# Altium project 一体机V1 修订2.PrjPcb (part 2 of 2)

## Sheet GPS POWER.SchDoc
size A4
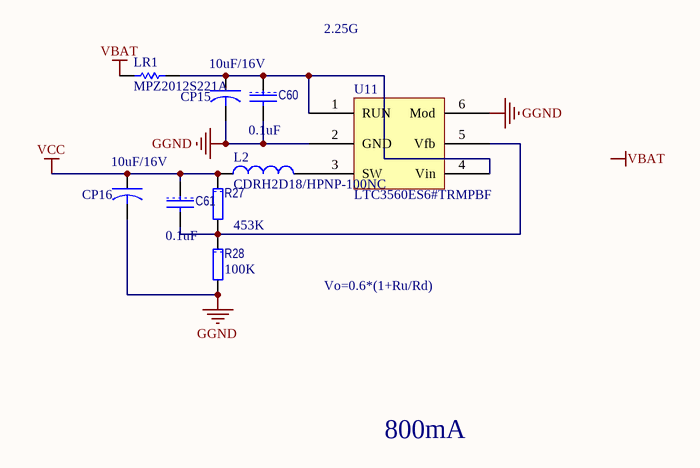
[diagram p21: GPS POWER.SchDoc]

### Parts
C60  value 0.1uF  [1608[0603]C]  (hidden comment: C1608X7R1H104K)
C61  value 0.1uF  [1608[0603]C]  (hidden comment: C1608X7R1H104K)
CP15  value 10uF/16V  [3216[1206]CB]  (hidden comment: TAJA106K016RNJ)
CP16  value 10uF/16V  [3216[1206]CB]  (hidden comment: TAJA106K016RNJ)
L2  CDRH2D18/HPNP-100NC  [INDP3232]
LR1  MPZ2012S221A  [2012[0805]]
R27  value 453K  [1608[0603]R]  (hidden comment: TNPW0603453KBEEN)
R28  value 100K  [1608[0603]R]  (hidden comment: CRCW0603100KFKEA)
U11  LTC3560ES6#TRMPBF  [SOT26A-6N]

### Nets
GGND: C60.2 CP15.2 CP16.2 R28.2 U11.2(GND) U11.6(Mod)  [project net GND]
VBAT: LR1.2
VCC: C61.1 CP16.1 L2.1 R27.1
NetC60_1: C60.1 CP15.1 LR1.1 U11.1(RUN) U11.4(Vin)
NetC61_2: C61.2 R27.2 R28.1 U11.5(Vfb)
NetL2_2: L2.2 U11.3(SW)

### Notes on the sheet
- 2.25G
- Vo=0.6*(1+Ru/Rd)
- 800mA
- Labels drawn without touching a wire or pin: VBAT

### Library data of the parts
C60 C61 = CAP: 多层陶瓷电容器MLCC - SMD/SMT 0603 0.1uF 50volts X7R 10%; Manufacturer: TDK; 产品: General Type MLCCs; 产品种类: Low & Medium Capacitance SMD Ceramic Chip Capacitors; 外壳代码 - in: 0603; 外壳代码 - mm: 1608; 封装 / 箱体: 0603 (1608 metric); 封装: Reel; 尺寸: 0.8 mm W x 1.6 mm L x 0.8 mm H; 工作温度范围: - 55 C to + 125 C; 标准包装数量: 4000; 电压额定值: 50 V; 电容-nF: 100 nF; 电容-pF: 100000 pF; 系列: C; Category: 多层陶瓷电容器MLCC - SMD/SMT; ComponentLink1Description: http://www.tdk.com/pdf/general_B11.pdf; ComponentLink1URL: http://www.tdk.com/pdf/general_B11.pdf; Description 1: 多层陶瓷电容器MLCC - SMD/SMT 0603 0.1uF 50volts X7R 10%; Manufacturer Part Number: C1608X7R1H104K; Minimum Order Quantity: 1; Pricing 1: 1=0.160, 50=0.070, 100=0.036, 500=0.019, 1000=0.013, 4000=0.010, 8000=0.009, 12000=0.008, 20000=0.007 (USD); Reeling: True; RoHS - 贸泽: Y; RoHS: RoHS Compliant; Stock 1: 224604; Supplier 1: Mouser; Supplier Part Number 1: 810-C1608X7R1H104K; 制造商: TDK; 容差: 10 %; 温度系数/代码: X7R; 电容: 0.1 uF; 端接类型: SMD/SMT
CP15 CP16 = CAPACITOR: 钽质电容器-固体SMD 16volts 10uF 10%; Manufacturer: AVX; ESR: 3 Ohms; 产品: Tantalum Solid Standard Grade - Other Various; 产品种类: SMD Tantalum Capacitors; 制造商库存号: A Case; 外壳代码 - in: 1206; 外壳代码 - mm: 3216; 封装 / 箱体: 1206 (3216 metric); 封装: Reel; 尺寸: 1.6 mm W x 3.2 mm L; 工作温度范围: - 55 C to + 125 C; 损耗因数 DF: 8; 标准包装数量: 2000; 漏泄电流: 1.6 uA; 电压额定值: 16 V; 端接类型: SMD/SMT; 系列: TAJ; 高度: 1.8 mm; Category: 钽质电容器-固体SMD; ComponentLink1Description: http://www.avx.com/docs/Catalogs/taj.pdf; ComponentLink1URL: http://www.avx.com/docs/Catalogs/taj.pdf; Description 1: 钽质电容器-固体SMD 16volts 10uF 10%; Manufacturer Part Number: TAJA106K016RNJ; Minimum Order Quantity: 1; Pricing 1: 1=0.600, 100=0.280, 200=0.250, 500=0.221, 1000=0.200, 2000=0.140, 5000=0.131, 10000=0.124, 25000=0.103 (USD); Reeling: True; RoHS - 贸泽: Y; RoHS: RoHS Compliant; Stock 1: 20335; Supplier 1: Mouser; Supplier Part Number 1: 581-TAJA106K016R; 制造商: AVX; 容差: 10 %; 电容: 10 uF
L2 = Inductor: 固定电感器 10uH 430mA; Manufacturer: Sumida; 尺寸: 3.2 mm W x 3.2 mm L x 2 mm H; 最大直流电流: 0.85 A; 最大直流电阻: 245 mOhms; 封装: Reel; 产品: SMD Power Inductor; 系列: CDRH; 屏蔽: Shielded; 端接类型: SMD/SMT; 容差: 30 %; 外壳高度: 2 mm; 外壳长度: 3.2 mm; 产品种类: SMD Power Inductors Shielded; 标准包装数量: 1000; 测试频率: 100 kHz; Supplier 1: Mouser; Supplier Part Number 1: 851-CDRH2D18HP-100NC; Manufacturer Part Number: CDRH2D18/HPNP-100NC; RoHS: RoHS Compliant; Description 1: 固定电感器 10uH 430mA; Category: 固定电感器; Stock 1: 1271; Pricing 1: 1=0.810, 10=0.650, 100=0.590, 500=0.540, 1000=0.490, 5000=0.450, 10000=0.410, 25000=0.370 (USD); 电感: 10 uH; 外壳宽度: 3.2 mm; 制造商: Sumida; RoHS - 贸泽: Y; Minimum Order Quantity: 1; Reeling: True; ComponentLink1URL: http://www.mouser.com/ds/2/390/cdrh2d18hp-189473.pdf; ComponentLink1Description: http://www.mouser.com/ds/2/390/cdrh2d18hp-189473.pdf; Value: 10uH
LR1 = Res Semi: 电磁干扰滤波珠子、扼流圈和阵列 Ferrite Chip Beads; Manufacturer: TDK; 阻抗: 220 Ohms; 最大直流电流: 3 A; 最大直流电阻: 0.04 Ohms; 工作温度范围: - 55 C to + 125 C; 封装 / 箱体: 2012; 封装: Reel; 端接类型: SMD/SMT; 容差: 25 %; 产品种类: Ferrite Beads; 标准包装数量: 4000; Supplier 1: Mouser; Supplier Part Number 1: 810-MPZ2012S221A; Manufacturer Part Number: MPZ2012S221A; RoHS: RoHS Compliant; Description 1: 电磁干扰滤波珠子、扼流圈和阵列 Ferrite Chip Beads; Category: 电磁干扰滤波珠子、扼流圈和阵列; Stock 1: 26540; Pricing 1: 1=0.070, 50=0.060, 100=0.053, 500=0.040, 1000=0.035, 4000=0.031, 8000=0.029, 12000=0.025 (USD); 制造商: TDK; RoHS - 贸泽: Y; Minimum Order Quantity: 1; Reeling: True; ComponentLink1URL: http://www.mouser.com/ds/2/400/e9413_mpz-24582.pdf; ComponentLink1Description: http://www.mouser.com/ds/2/400/e9413_mpz-24582.pdf
R27 = RES: 薄膜电阻器 - SMD 453Kohms .1% 25ppm; Manufacturer: Vishay; Manufacturer Part Number: TNPW0805453KBEEN; 尺寸: 1.25 mm W x 2 mm L x 0.45 mm H; 工作温度范围: - 55 C to + 155 C; 封装 / 箱体: 0805 (2012 metric); 封装: Reel; 功率额定值: 125 mW (1/8 W); 产品: Precision Resistors Thin Film SMD; 系列: TNPW; 温度系数: 25 PPM / K; 端接类型: SMD/SMT; 容差: 0.1 %; 电压额定值: 150 V; 外壳高度: 0.45 mm; 外壳长度: 2 mm; 外壳宽度: 1.25 mm; 产品种类: 0805 Precision Thin Film Chip Resistors; 标准包装数量: 1000; Supplier 1: Mouser; Supplier Part Number 1: 71-TNPW0805453KBEEN; RoHS: RoHS Compliant; Description 1: 薄膜电阻器 - SMD 453Kohms .1% 25ppm; Category: 薄膜电阻器 - SMD; Stock 1: 0; Pricing 1: 1=0.940, 50=0.800, 100=0.650, 500=0.580, 1000=0.522, 2000=0.464, 4000=0.455, 6000=0.450, 8000=0.440 (USD); 电阻: 453 kOhms; 制造商: Vishay; RoHS - 贸泽: E; Minimum Order Quantity: 1; Reeling: True; ComponentLink1URL: http://www.vishay.com/doc?28758; ComponentLink1Description: http://www.vishay.com/doc?28758
R28 = RES: as R73 on sheet 12-MSP430; Supplier 1: Mouser; Supplier Part Number 1: 71-CRCW0603-100K-E3; Manufacturer Part Number: CRCW0603100KFKEA; RoHS: RoHS Compliant By Exemption; Category: 厚膜电阻器 - SMD; Stock 1: 175756; Pricing 1: 1=0.080, 10=0.013, 100=0.010, 1000=0.008, 5000=0.005, 25000=0.004, 50000=0.003 (USD); 电阻: 100 kOhms; 容差: 1 %; RoHS - 贸泽: E; Minimum Order Quantity: 1; Reeling: True; ComponentLink1URL: http://www.mouser.com/ds/2/427/dcrcwe3-109170.pdf; ComponentLink1Description: http://www.mouser.com/ds/2/427/dcrcwe3-109170.pdf; Description 1: 厚膜电阻器 - SMD 1/10watt 100Kohms 1%
U11 = LTC3405A: IC REG BUCK SYNC ADJ TSOT23-6; Manufacturer: Linear Technology; Output Type: Adjustable; Number of Outputs: 1; Voltage - Output: 0.6 V ~ 5.5 V; Voltage - Input: 2.5 V ~ 5.5 V; PWM Type: Current Mode, Burst Mode?; Frequency - Switching: 2.25MHz; Current - Output: 800mA; Synchronous Rectifier: Yes; Supplier 1: Digi-Key; Supplier Part Number 1: LTC3560ES6#TRMPBFCT-ND; Manufacturer Part Number: LTC3560ES6#TRMPBF; RoHS: RoHS Compliant; Description 1: IC REG BUCK SYNC ADJ TSOT23-6; Category: Integrated Circuits (ICs); Stock 1: 2081; Pricing 1: 1=4.39, 25=3.9196, 100=3.5276 (USD); Packaging: Cut Tape (CT); Type: Step-Down (Buck); Operating Temperature: -40°C ~ 85°C; Mounting Type: Surface Mount; Package / Case: SOT-23-6 Thin, TSOT-23-6; Supplier Device Package: TSOT-23-6; ComponentLink1URL: http://www.linear.com/docs/18318; ComponentLink1Description: http://www.linear.com/docs/18318

## Sheet BAT POWER.SchDoc
size A4
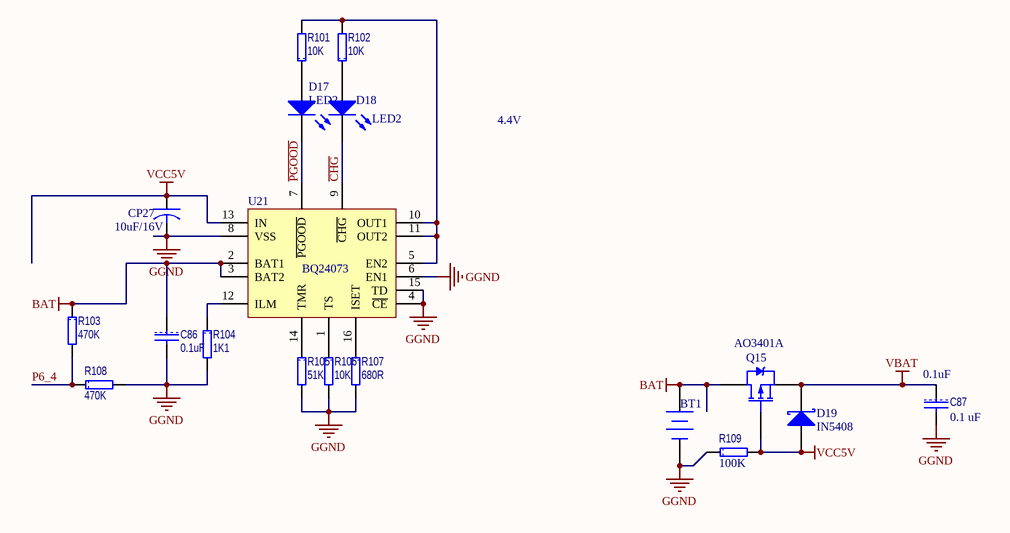
[diagram p22: BAT POWER.SchDoc]

### Parts
BT1  Battery  [BAT-2]  (value not drawn)
C86  0.1uF  [1608[0603]]
C87  value 0.1uF  电容: 0.1 uF  [1608[0603]C]  (hidden comment: C1608X7R1H104K)
CP27  10uF/16V  [3216[1206]]
D17  LED2  [0805LED]
D18  LED2  [0805LED]
D19  IN5408  [DO-214AB/SMC]
Q15  AO3401A  [SOT23_N]
R101  10K  [1608[0603]R]
R102  10K  [1608[0603]R]
R103  470K  [1608[0603]R]
R104  1K1  [1608[0603]R]
R105  51K  [1608[0603]R]
R106  10K  [1608[0603]R]
R107  680R  [1608[0603]R]
R108  470K  [1608[0603]R]
R109  value 100K  [1608[0603]R]  (hidden comment: CRCW0603100KFKEA)
U21  BQ24073  [BQ24073]

### Nets
BAT: BT1.1(+) C86.1 Q15.3(D) R103.1 U21.2(BAT1) U21.3(BAT2)
GGND: BT1.2(-) C86.2 C87.2 CP27.2 R104.2 R105.2 R106.2 R107.2 R108.2 R109.1 U21.4(~{CE}) U21.6(EN1) U21.8(VSS) U21.15(TD)  [project net GND]
VBAT: C87.1 D19.2(K) Q15.2(S)
VCC5V: CP27.1 D19.1(A) Q15.1(G) R109.2 U21.13(IN)
~{CHG}: D18.2(K) U21.9(~{CHG})
P6_4: R103.2 R108.1
~{PGOOD}: D17.2(K) U21.7(~{PGOOD})
NetD17_1: D17.1(A) R101.1
NetD18_1: D18.1(A) R102.1
NetR101_2: R101.2 R102.2 U21.5(EN2) U21.10(OUT1) U21.11(OUT2)
NetR104_1: R104.1 U21.12(ILM)
NetR105_1: R105.1 U21.14(TMR)
NetR106_1: R106.1 U21.1(TS)
NetR107_1: R107.1 U21.16(ISET)

### Notes on the sheet
- 4.4V

### Library data of the parts
BT1 = Battery: 插针 Multicell Battery; Published: 24-Mar-1999; LatestRevisionDate: 17-Jul-2002; LatestRevisionNote: Re-released for DXP Platform.; PackageReference: BAT-2; Publisher: Altium Limited
C86 = CAP: Capacitor; Manufacturer: TDK; Type: 无铅电容; Model: C0603X7R1H104K; Value: 0.1uF
C87 = CAP: 多层陶瓷电容器MLCC - SMD/SMT 0603 0.1uF 50volts X7R 10%; Manufacturer: TDK; 尺寸: 0.8 mm W x 1.6 mm L x 0.8 mm H; 工作温度范围: - 55 C to + 125 C; 封装 / 箱体: 0603 (1608 metric); 封装: Reel; 产品: General Type MLCCs; 系列: C; 电压额定值: 50 V; 电容-nF: 100 nF; 电容-pF: 100000 pF; 外壳代码 - in: 0603; 外壳代码 - mm: 1608; 产品种类: Low & Medium Capacitance SMD Ceramic Chip Capacitors; 标准包装数量: 4000; Supplier 1: Mouser; Supplier Part Number 1: 810-C1608X7R1H104K; Manufacturer Part Number: C1608X7R1H104K; RoHS: RoHS Compliant; Description 1: 多层陶瓷电容器MLCC - SMD/SMT 0603 0.1uF 50volts X7R 10%; Category: 多层陶瓷电容器MLCC - SMD/SMT; Stock 1: 224604; Pricing 1: 1=0.160, 50=0.070, 100=0.036, 500=0.019, 1000=0.013, 4000=0.010, 8000=0.009, 12000=0.008, 20000=0.007 (USD); 端接类型: SMD/SMT; 容差: 10 %; 制造商: TDK; 温度系数/代码: X7R; RoHS - 贸泽: Y; Minimum Order Quantity: 1; Reeling: True; ComponentLink1URL: http://www.tdk.com/pdf/general_B11.pdf; ComponentLink1Description: http://www.tdk.com/pdf/general_B11.pdf
CP27 = CAPACITOR: Tantalum Capacitor; 公司: TAJ; name: TAJ-A-106-M-010-R; value: 10uF/16V
D17 D18 = LED2: Typical RED, GREEN, YELLOW, AMBER GaAs LED; Published: 8-Jun-2000; LatestRevisionDate: 17-Jul-2002; LatestRevisionNote: Re-released for DXP Platform.; PackageVersion: Feb-2002; PackageReference: 3.2X1.6X1.1; Publisher: Altium Limited; PackageDescription: SM LED; 2 Flat Leads
D19 = D Schottky: 肖特基二极管与整流器 3.0 Amp 60 Volt; Manufacturer: Vishay Semiconductors; Manufacturer Part Number: SS36-E3/57T; 配置: Single; 工作温度范围: - 55 C to + 150 C; 封装 / 箱体: SMC (DO-214AB); 封装: Reel; 产品: Schottky Rectifiers; 正向连续电流: 3 A; 最大浪涌电流: 100 A; 安装风格: SMD/SMT; 正向电压下降: 0.75 V; 制造商: Vishay; 最大反向漏泄电流: 500 uA; 峰值反向电压: 60 V; 标准包装数量: 850; Supplier 1: Mouser; Supplier Part Number 1: 625-SS36-E3; RoHS: RoHS Compliant By Exemption; Description 1: 肖特基二极管与整流器 3.0 Amp 60 Volt; Category: 肖特基二极管与整流器; Stock 1: 481; Pricing 1: 1=0.280, 10=0.250, 100=0.188, 250=0.154, 500=0.144, 850=0.144, 1000=0.139, 2000=0.131 (USD); 产品种类: Schottky Rectifiers; RoHS - 贸泽: E; Minimum Order Quantity: 1; Reeling: True; ComponentLink1URL: http://www.mouser.com/ds/2/427/88751-106389.pdf; ComponentLink1Description: http://www.mouser.com/ds/2/427/88751-106389.pdf
Q15 = IRLML5103: MOSFET P-CH -30V -4.3A SOT23; Manufacturer: Alpha & Omega Semiconductor Inc; FET Type: MOSFET P-Channel, Metal Oxide; FET Feature: Logic Level Gate, 2.5V Drive; Drain to Source Voltage (Vdss): 30V; Current - Continuous Drain (Id) @ 25° C: 4.3A (Ta); Rds On (Max) @ Id, Vgs: 44 mOhm @ 4.3A, 10V; Vgs(th) (Max) @ Id: 1.3V @ 250μA; Gate Charge (Qg) @ Vgs: 12.2nC @ 4.5V; Input Capacitance (Ciss) @ Vds: 1200pF @ 15V; Power - Max: 1.4W; Supplier 1: Digi-Key; Supplier Part Number 1: 785-1001-6-ND; Manufacturer Part Number: AO3401A; RoHS: RoHS Compliant; Description 1: MOSFET P-CH -30V -4.3A SOT23; Category: Discrete Semiconductor Products; Stock 1: 75922; Pricing 1: 1=0.48, 25=0.2792, 100=0.225, 250=0.162, 500=0.1305, 1000=0.10125 (USD); Packaging: Digi-Reel?; Mounting Type: Surface Mount; Package / Case: TO-236-3, SC-59, SOT-23-3; Supplier Device Package: SOT-23-3; ComponentLink1URL: http://www.aosmd.com/res/data_sheets/AO3401A.pdf; ComponentLink1Description: http://www.aosmd.com/res/data_sheets/AO3401A.pdf
R101 R102 = RES: Model: CRCW060310K0KKEDTR; 公司: vishay; Parameters: 50V 1/10W 0.5%; Type: 无铅电阻; Value: 10K
R103 R108 = RES: Manufacturer: vishay; Model: CRCW0603470K0KKEDTR; Value: 470K; Type: 无铅电阻
R104 = RES: Manufacturer: vishay; Model: RT0603DRD7D1K1L; Parameters: 50V 1/10W 0.5%; Type: 无铅电阻; Value: 1K1
R105 = RES: Manufacturer: vishay; Model: RT0603DRD7D51KL; Parameters: 50V 1/10W 0.5%; Type: 无铅电阻; Value: 51K
R106 = RES: Manufacturer: vishay; Model: CRCW060310K0KKEDTR; Parameters: 50V 1/10W 0.5%; Type: 无铅电阻; Value: 10K
R107 = RES: Manufacturer: vishay; Model: RT0603DRD7D680RL; Parameters: 50V 1/10W 0.5%; Type: 无铅电阻; Value: 680R
R109 = RES: as R73 on sheet 12-MSP430; Supplier 1: Mouser; Supplier Part Number 1: 71-CRCW0603-100K-E3; Manufacturer Part Number: CRCW0603100KFKEA; RoHS: RoHS Compliant By Exemption; Category: 厚膜电阻器 - SMD; Stock 1: 175756; Pricing 1: 1=0.080, 10=0.013, 100=0.010, 1000=0.008, 5000=0.005, 25000=0.004, 50000=0.003 (USD); 电阻: 100 kOhms; 容差: 1 %; RoHS - 贸泽: E; Minimum Order Quantity: 1; Reeling: True; ComponentLink1URL: http://www.mouser.com/ds/2/427/dcrcwe3-109170.pdf; ComponentLink1Description: http://www.mouser.com/ds/2/427/dcrcwe3-109170.pdf; Description 1: 厚膜电阻器 - SMD 1/10watt 100Kohms 1%

## Sheet CD4060BM_硬件定时器.SchDoc
size A4
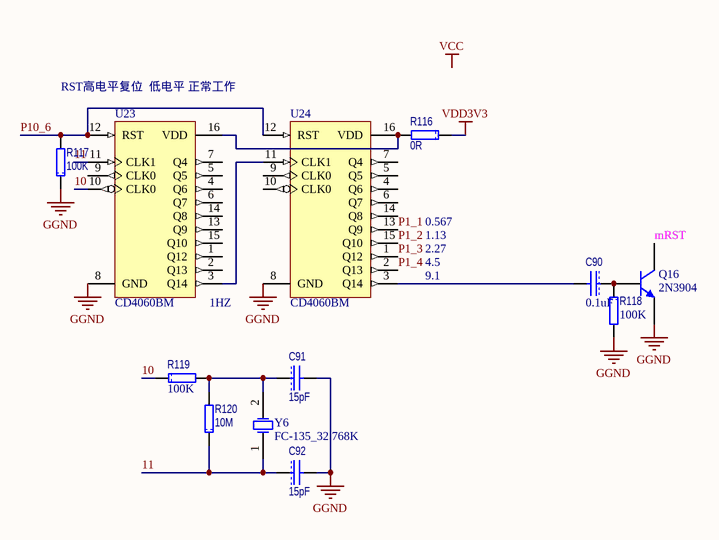
[diagram p23: CD4060BM_硬件定时器.SchDoc]

### Parts
C90  value 0.1uF  [1608[0603]C]  (hidden comment: C1608X7R1H104K)
C91  15pF  [1608[0603]]
C92  15pF  [1608[0603]]
Q16  2N3904  [SOT23_N]
R116  0R  [1608[0603]R]
R117  100K  [1608[0603]R]
R118  value 100K  [1608[0603]R]  (hidden comment: CRCW0603100KFKEA)
R119  value 100K  [1608[0603]R]  (hidden comment: CRCW0603100KFKEA)
R120  10M  [1608[0603]R]
U23  CD4060BM  [SOIC16_N]
U24  CD4060BM  [SOIC16_N]
Y6  FC-135_32.768K  [FC-135]

### Nets
GGND: C91.2 C92.2 Q16.1(E) R117.1 R118.2 U23.8(GND) U24.8(GND)  [project net GND]
VDD3V3: R116.1
10: R119.1 U23.10(CLK0)
11: C92.1 R120.1 U23.11(CLK1) Y6.1(OSC1)
mRST: Q16.3(C)
P1_1: U24.13(Q9)
P1_2: U24.15(Q10)
P1_3: U24.1(Q12)
P1_4: U24.2(Q13)
P10_6: R117.2 U23.12(RST) U24.12(RST)
NetC90_1: C90.1 Q16.2(B) R118.1
NetC90_2: C90.2 U24.3(Q14)
NetC91_1: C91.1 R119.2 R120.2 Y6.2(OSC2)
NetR116_2: R116.2 U23.16(VDD) U24.16(VDD)
NetU23_3: U23.3(Q14) U24.11(CLK1)

Not connected (* = marked no-connect by the designer): U23 1(Q12) 2(Q13) 4(Q6) 5(Q5) 6(Q7) 7(Q4) 9(CLK0) 13(Q9) 14(Q8) 15(Q10); U24 4(Q6) 5(Q5) 6(Q7) 7(Q4) 9(CLK0) 10(CLK0) 14(Q8)

### Notes on the sheet
- RST高电平复位  低电平 正常工作
- 2.27
- 1.13
- 0.567
- (near U23) 1HZ
- 9.1
- 4.5
- Labels drawn without touching a wire or pin: VCC

### Library data of the parts
C90 = CAP: 多层陶瓷电容器MLCC - SMD/SMT 0603 0.1uF 50volts X7R 10%; Manufacturer: TDK; 产品: General Type MLCCs; 产品种类: Low & Medium Capacitance SMD Ceramic Chip Capacitors; 外壳代码 - in: 0603; 外壳代码 - mm: 1608; 封装 / 箱体: 0603 (1608 metric); 封装: Reel; 尺寸: 0.8 mm W x 1.6 mm L x 0.8 mm H; 工作温度范围: - 55 C to + 125 C; 标准包装数量: 4000; 电压额定值: 50 V; 电容-nF: 100 nF; 电容-pF: 100000 pF; 系列: C; Category: 多层陶瓷电容器MLCC - SMD/SMT; ComponentLink1Description: http://www.tdk.com/pdf/general_B11.pdf; ComponentLink1URL: http://www.tdk.com/pdf/general_B11.pdf; Description 1: 多层陶瓷电容器MLCC - SMD/SMT 0603 0.1uF 50volts X7R 10%; Manufacturer Part Number: C1608X7R1H104K; Minimum Order Quantity: 1; Pricing 1: 1=0.160, 50=0.070, 100=0.036, 500=0.019, 1000=0.013, 4000=0.010, 8000=0.009, 12000=0.008, 20000=0.007 (USD); Reeling: True; RoHS - 贸泽: Y; RoHS: RoHS Compliant; Stock 1: 224604; Supplier 1: Mouser; Supplier Part Number 1: 810-C1608X7R1H104K; 制造商: TDK; 容差: 10 %; 温度系数/代码: X7R; 电容: 0.1 uF; 端接类型: SMD/SMT
C91 C92 = CAP: Capacitor; Manufacturer: TDK; Type: 无铅电容; Model: C0603X7R1H150K; Value: 15pF
Q16 = 2N3904: NPN General Purpose Amplifier; Published: 8-Jun-2000; LatestRevisionDate: 15-Jan-2003; LatestRevisionNote: PCB Footprint 'BCY-W3/D4.7' replaced; DatasheetVersion: 1997; PackageVersion: Sep-1998; PackageReference: TO-92A; Publisher: Altium Limited; PackageDescription: TO, Flat Index; 3 In-Line, Axial Leads; Body Dia. 4.5mm; Leads 0.51 x 0.48 mm (max); ComponentLink1Description: Manufacturer Link; ComponentLink1URL: http://www.fairchildsemi.com/; ComponentLink2Description: Datasheet; ComponentLink2URL: http://www.fairchildsemi.com/ds/2N%2F2N3904.pdf
R116 = RES: Model: RT0603DRD7D0RL; 公司: vishay; Parameters: 50V 1/10W 0.5%; Type: 无铅电阻; Value: 0R
R117 = RES: Model: RT0603DRD7D100KL; 公司: vishay; Parameters: 50V 1/10W 0.5%; Type: 无铅电阻; Value: 100K
R118 R119 = RES: 厚膜电阻器 - SMD 1/10watt 100Kohms 1%; Manufacturer: Vishay / Dale; 尺寸: 0.85 mm W x 1.55 mm L x 0.45 mm H; 工作温度范围: - 55 C to + 155 C; 封装 / 箱体: 0603 (1608 metric); 封装: Reel; 功率额定值: 100 mW; 产品: Thick Film Resistors SMD; 系列: CRCW; 温度系数: 100 PPM / K; 端接类型: SMD/SMT; 电压额定值: 75 V; 制造商: Vishay; 产品种类: 0603 Thick Film Chip Resistors; 标准包装数量: 5000; 外壳代码 - in: 0603; 外壳代码 - mm: 1608; Supplier 1: Mouser; Supplier Part Number 1: 71-CRCW0603-100K-E3; Manufacturer Part Number: CRCW0603100KFKEA; RoHS: RoHS Compliant By Exemption; Category: 厚膜电阻器 - SMD; Stock 1: 175756; Pricing 1: 1=0.080, 10=0.013, 100=0.010, 1000=0.008, 5000=0.005, 25000=0.004, 50000=0.003 (USD); 电阻: 100 kOhms; 容差: 1 %; RoHS - 贸泽: E; Minimum Order Quantity: 1; Reeling: True; ComponentLink1URL: http://www.mouser.com/ds/2/427/dcrcwe3-109170.pdf; ComponentLink1Description: http://www.mouser.com/ds/2/427/dcrcwe3-109170.pdf; Description 1: 厚膜电阻器 - SMD 1/10watt 100Kohms 1%
R120 = RES: Model: RT0603DRD7D10ML; 公司: vishay; Parameters: 50V 1/10W 0.5%; Type: 无铅电阻; Value: 10M
U23 U24 = CD4060BCM: 14-Stage Ripple Carry Binary Counter; Published: 17-Jul-2002; LatestRevisionDate: 13-Apr-2006; LatestRevisionNote: IPC-7351 Footprint Added.; DatasheetVersion: Jan-1999; PackageVersion: 2000; PackageReference: M16A; Publisher: Altium Limited; PackageDescription: 16-Pin Small Outline Integrated Circuit 1.27 mm Pitch; Code_IPC: SOIC127P600-16; ComponentLink1Description: Manufacturer Link; ComponentLink1URL: http://www.fairchildsemi.com/; ComponentLink2Description: Datasheet; ComponentLink2URL: http://www.fairchildsemi.com/ds/CD%2FCD4040BC.pdf
Y6 = XTAL: Crystal Oscillator; 公司: EPSON; Published: 8-Jun-2000; LatestRevisionDate: 17-Jul-2002; LatestRevisionNote: Re-released for DXP Platform.; PackageReference: R38; Publisher: Altium Limited; PackageDescription: Crystal, Thru-Hole; 2 Leads; Body 3.1 x 8.2 mm (Dia.xH); Value: 32.768K

## Nets that join several sheets
GND: ARM POWER (12 pins), MAIN POWER (12 pins), JTAG (R48.2), RTC (B1.2), 按键接口 (5 pins), IIC (7 pins), RESET (C66.2 U13.1), USB Device (R57.2 U14.2 US1.5), USB Host (C83.2 C84.2 R97.2 R100.2), 蜂鸣器 (Q5.2 R69.2), Cores POWER (6 pins), LVDS (7 pins), 12-MSP430 (22 pins), 13-GPRS (16 pins), 14-GPS (17 pins), GPS POWER (6 pins), BAT POWER (14 pins), CD4060BM_硬件定时器 (7 pins)
VAA5V: ARM POWER (C54.1 CP9.1 U8.3), MAIN POWER (Q2.3 R52.2 RD7.2), 按键接口 (CP18.1 RF3.2), USB Device (US1.1), Cores POWER (C58.1 CP13.1 U10.3)
VBAT: 13-GPRS (5 pins), 14-GPS (LR4.2 R89.2 R90.2), GPS POWER (LR1.2), BAT POWER (C87.1 D19.2 Q15.2)
VCC: 12-MSP430 (20 pins), GPS POWER (C61.1 CP16.1 L2.1 R27.1)
VCC5V: MAIN POWER (D7.1 RT1.2), BAT POWER (5 pins)
VDD3V3: JTAG (R43.1 R44.1 R45.1 R46.1), 按键接口 (R67.1), 指示灯 (R62.2 R63.2 R64.2), IIC (5 pins), RESET (C66.1 R55.1 U13.4), USB Device (R59.2), 蜂鸣器 (U15.1), Cores POWER (RD6.2), LVDS (J6.28 J6.29 R114.1), 12-MSP430 (R71.1), CD4060BM_硬件定时器 (R116.1)
ACC24: MAIN POWER (C65.1 R49.1 R50.2), 12-MSP430 (U16.100)
GPRS_ON: 12-MSP430 (U16.45), 13-GPRS (Q10.1)
GPRS_PWR: 12-MSP430 (U16.43), 13-GPRS (Q6.1 R76.2)
GPS_PWR: 12-MSP430 (U16.51), 14-GPS (R88.1 U19.3)
mRST: 12-MSP430 (5 pins), CD4060BM_硬件定时器 (Q16.3)
NETLIGHT: 12-MSP430 (U16.50), 13-GPRS (Q9.1 U17.21)
P1_3: 12-MSP430 (U16.20), CD4060BM_硬件定时器 (U24.1)
P1_4: 12-MSP430 (U16.21), CD4060BM_硬件定时器 (U24.2)
P3_4: 12-MSP430 (U16.39), 13-GPRS (R78.2)
P3_5: 12-MSP430 (U16.40), 13-GPRS (R77.2)
P5_6: 12-MSP430 (U16.53), 14-GPS (R92.2)
P5_7: 12-MSP430 (U16.54), 14-GPS (R91.2)
P6_4: 12-MSP430 (U16.1), BAT POWER (R103.2 R108.1)
P10_6: 12-MSP430 (U16.82), CD4060BM_硬件定时器 (R117.2 U23.12 U24.12)
PLUSE: 12-MSP430 (U16.32 U16.55), 14-GPS (Q12.1 U20.28)
RESET: JTAG (R47.2), RESET (R55.2 R56.1 U13.2)
RI: 12-MSP430 (U16.31), 13-GPRS (Q7.1 U17.23)
STATUS: 12-MSP430 (U16.48), 13-GPRS (Q8.1 U17.22)

## Assembly variants
Variant of S3C2440V6: all parts fitted